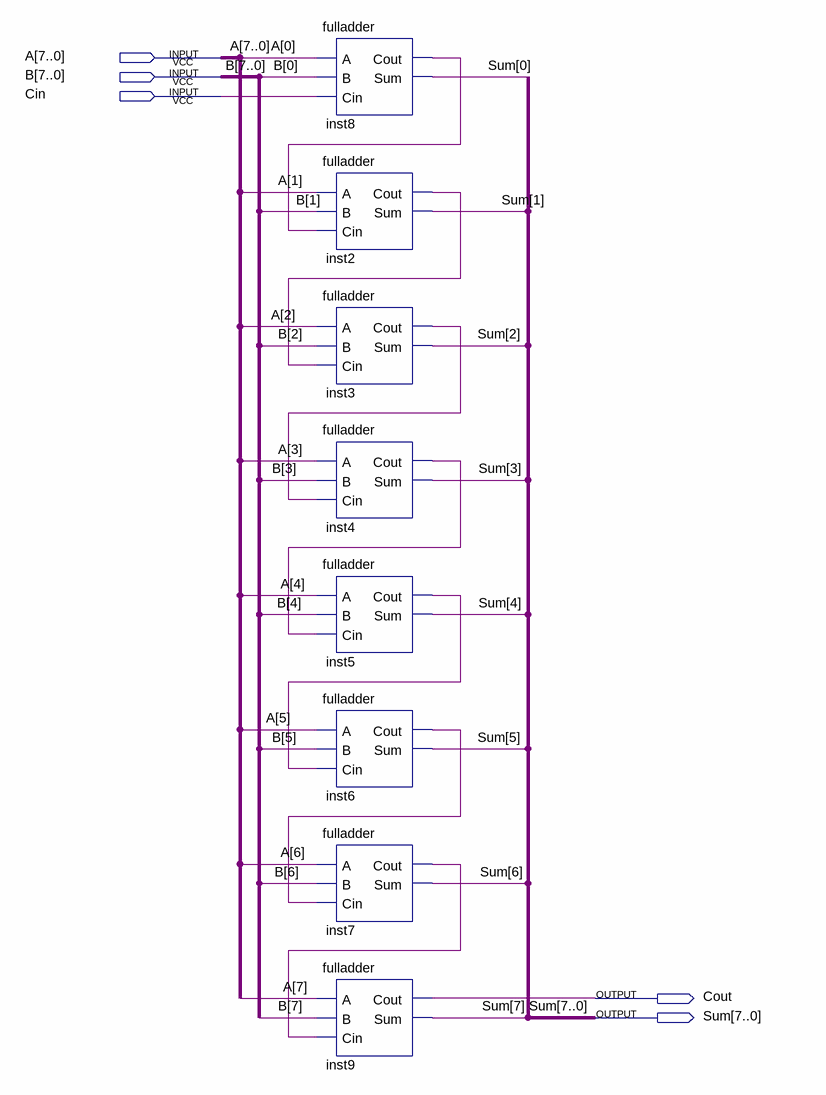
[diagram p0: schematic sheet]
// Quartus schematic adder_8.bdf as structural Verilog: 8 symbols, 5 pins
module adder_8 (
  input  [7:0] A,
  input  [7:0] B,
  input  Cin,
  output Cout,
  output [7:0] Sum
);

  wire inst2_cout, inst3_cout, inst4_cout, inst5_cout, inst6_cout, inst7_cout, inst8_cout;

  fulladder inst8 (.A(A[0]), .B(B[0]), .Cin(Cin), .Cout(inst8_cout), .Sum(Sum[0]));
  fulladder inst2 (.A(A[1]), .B(B[1]), .Cin(inst8_cout), .Cout(inst2_cout), .Sum(Sum[1]));
  fulladder inst3 (.A(A[2]), .B(B[2]), .Cin(inst2_cout), .Cout(inst3_cout), .Sum(Sum[2]));
  fulladder inst4 (.A(A[3]), .B(B[3]), .Cin(inst3_cout), .Cout(inst4_cout), .Sum(Sum[3]));
  fulladder inst5 (.A(A[4]), .B(B[4]), .Cin(inst4_cout), .Cout(inst5_cout), .Sum(Sum[4]));
  fulladder inst6 (.A(A[5]), .B(B[5]), .Cin(inst5_cout), .Cout(inst6_cout), .Sum(Sum[5]));
  fulladder inst7 (.A(A[6]), .B(B[6]), .Cin(inst6_cout), .Cout(inst7_cout), .Sum(Sum[6]));
  fulladder inst9 (.A(A[7]), .B(B[7]), .Cin(inst7_cout), .Cout(Cout), .Sum(Sum[7]));
endmodule
